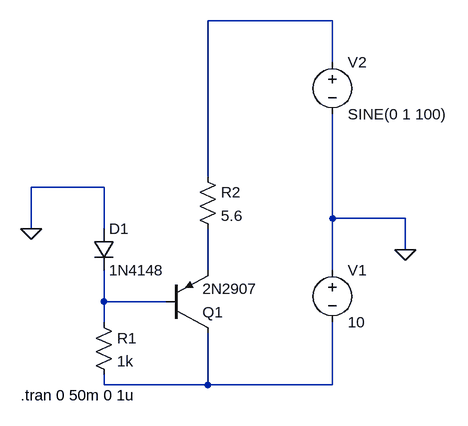
[diagram p0: schematic class_AB_subsystem_drain.asc]
class_AB_subsystem_drain.asc, the LTspice schematic file:
Version 4
SHEET 1 880 680
WIRE 464 -192 272 -192
WIRE 464 -128 464 -192
WIRE 272 48 272 -192
WIRE 112 64 0 64
WIRE 464 112 464 -48
WIRE 576 112 464 112
WIRE 0 128 0 64
WIRE 112 128 112 64
WIRE 576 160 576 112
WIRE 272 192 272 128
WIRE 464 192 464 112
WIRE 112 240 112 192
WIRE 208 240 112 240
WIRE 112 272 112 240
WIRE 112 368 112 352
WIRE 272 368 272 288
WIRE 272 368 112 368
WIRE 464 368 464 272
WIRE 464 368 272 368
FLAG 576 160 0
FLAG 0 128 0
SYMBOL pnp2 208 288 M180
SYMATTR InstName Q1
SYMATTR Value 2N2907
SYMBOL voltage 464 176 R0
WINDOW 123 0 0 Left 0
WINDOW 39 0 0 Left 0
SYMATTR InstName V1
SYMATTR Value 10
SYMBOL diode 96 128 R0
SYMATTR InstName D1
SYMATTR Value 1N4148
SYMBOL res 96 256 R0
SYMATTR InstName R1
SYMATTR Value 1k
SYMBOL res 256 32 R0
SYMATTR InstName R2
SYMATTR Value 5.6
SYMBOL voltage 464 -144 R0
WINDOW 123 0 0 Left 0
WINDOW 39 0 0 Left 0
SYMATTR InstName V2
SYMATTR Value SINE(0 1 100)
TEXT -16 384 Left 2 !.tran 0 50m 0 1u

The netlist it stands for:
* class_AB_subsystem_drain.asc
Q1 N004 N003 N002 0 2N2907
V1 0 N004 10
D1 0 N003 1N4148
R1 N003 N004 1k
R2 N001 N002 5.6
V2 N001 0 SINE(0 1 100)
.model D D
.lib standard.dio
.model NPN NPN
.model PNP PNP
.lib standard.bjt
.tran 0 50m 0 1u
.backanno
.end